# EAGLE design front_end_block (EAGLE 6.5.0)
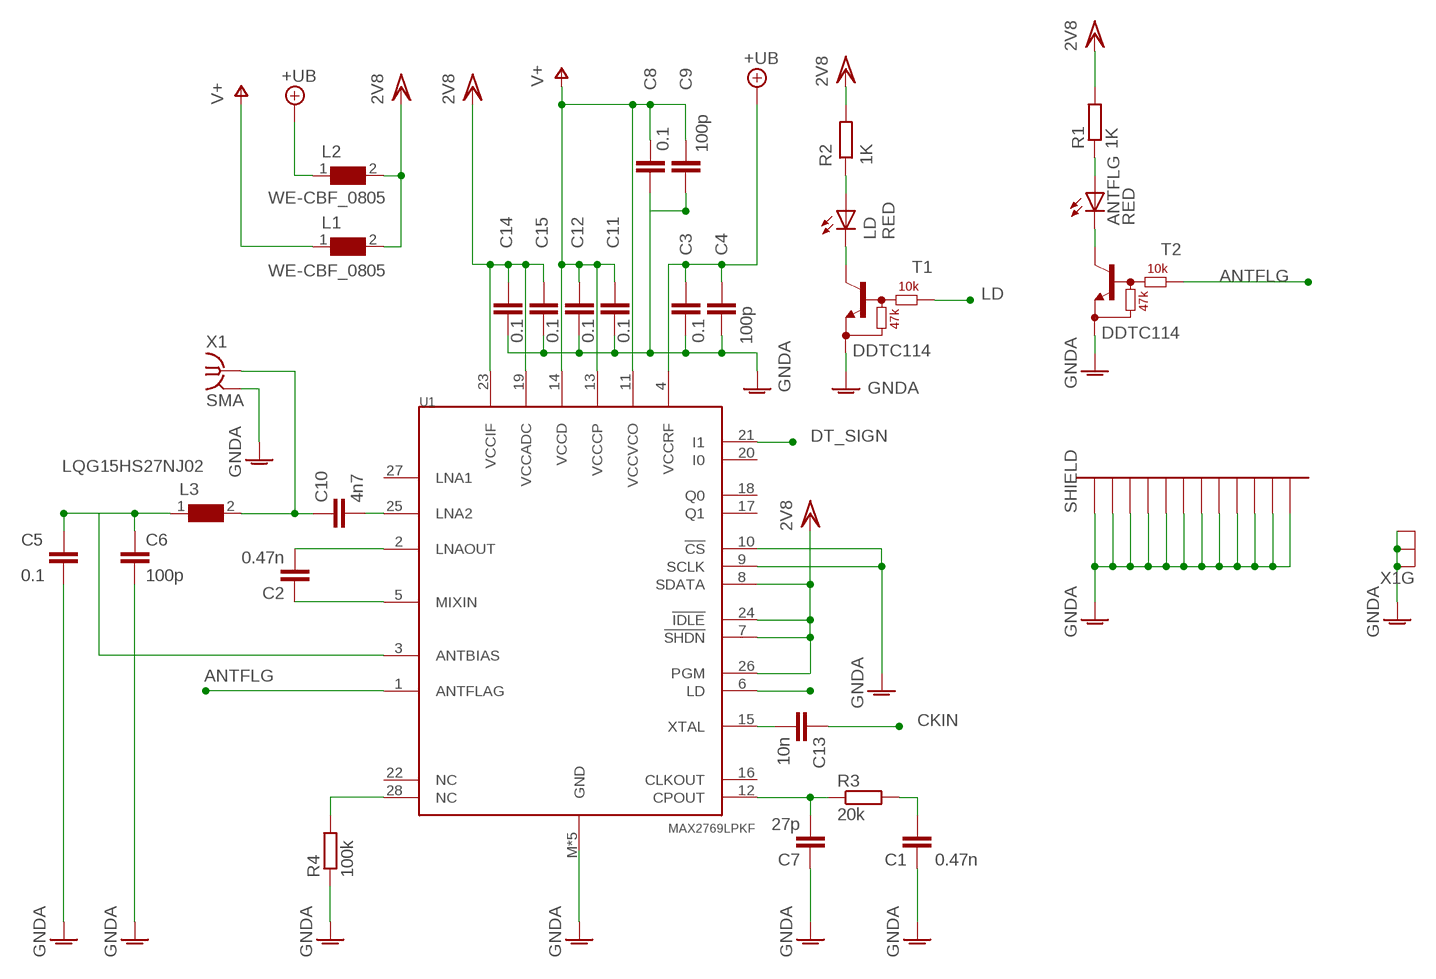
[diagram p0: schematic, sheet 1]

## Parts
ANTFLG  RED  LEDCHIP-LED0603  [CHIP-LED0603]
C1  0.47n  C-EUC0603  [C0603]
C2  0.47n  C-EUC0402  [C0402]
C3  0.1  C-EUC0402  [C0402]
C4  100p  C-EUC0402  [C0402]
C5  0.1  C-EUC0603  [C0603]
C6  100p  C-EUC0402  [C0402]
C7  27p  C-EUC0402  [C0402]
C8  0.1  C-EUC0402  [C0402]
C9  100p  C-EUC0402  [C0402]
C10  4n7  C-EUC0402  [C0402]
C11  0.1  C-EUC0402  [C0402]
C12  0.1  C-EUC0402  [C0402]
C13  10n  C-EUC0402  [C0402]
C14  0.1  C-EUC0603  [C0603]
C15  0.1  C-EUC0402  [C0402]
L1  WE-CBF_0805  [0805]
L2  WE-CBF_0805  [0805]
L3  LQG15HS27NJ02  WE-MK_0402  [0402]
LD  RED  LEDCHIP-LED0603  [CHIP-LED0603]
R1  1K  R-EU_R0402  [R0402]
R2  1K  R-EU_R0402  [R0402]
R3  20k  R-EU_R0402  [R0402]
R4  100k  R-EU_R0402  [R0402]
S2  BMIS-202  [BMIS-202]
T1  DDTC114  BCR135W  [SOT323-R_INFINEON]
T2  DDTC114  BCR135W  [SOT323-R_INFINEON]
U1  MAX2769LPKF  [QFN28LPKF]
X1  SMA  SMA-142-0701-801/806  [J502-ND-142-0701-801/806]

## Nets
+UB: C3.1 C4.1 L2.1 U1.4(VCCRF)
ANTFLG: T2.1(B) U1.1(ANTFLAG)
CKIN: C13.1
DT_SIGN: U1.21(I1)
GNDA: C1.1 C3.2 C4.2 C5.2 C6.2 C7.1 C8.2 C9.2 C11.2 C12.2 C14.2 C15.2 R4.1 S2.P$1(GND) S2.P$2(GND) S2.P$3(GND) S2.P$4(GND) S2.P$5(GND) S2.P$6(GND) S2.P$7(GND) S2.P$8(GND) S2.P$9(GND) S2.P$10(GND) S2.P$11(GND) S2.P$12(GND) T1.2(E) T2.2(E) U1.9(SCLK) U1.10(!CS) U1.M(GND) U1.P$4(GND) U1.P$6(GND) U1.P$7(GND) U1.P$9(GND) X1.G@1(GND) X1.G@2(GND) X1.G@3(GND) X1.G@4(GND)
LD: T1.1(B) U1.6(LD)
LNA2: C10.2 U1.25(LNA2)
LNAOUT: C2.2 U1.2(LNAOUT)
MIXIN: C2.1 U1.5(MIXIN)
N$1: C7.2 R3.1 U1.12(CPOUT)
N$3: C1.2 R3.2
N$5: C5.1 C6.1 L3.1 U1.3(ANTBIAS)
N$7: ANTFLG.A R1.1
N$8: ANTFLG.C T2.3(C)
N$16: LD.A R2.1
N$17: LD.C T1.3(C)
N$18: R4.2 U1.28(NC)
N$33: C10.1 L3.2 X1.1
V+: C8.1 C9.1 C11.1 C12.1 L1.1 U1.11(VCCVCO) U1.13(VCCCP) U1.14(VCCD)
VCC/2: C14.1 C15.1 L1.2 L2.2 R1.2 R2.2 U1.7(!SHDN) U1.8(SDATA) U1.19(VCCADC) U1.23(VCCIF) U1.24(!IDLE) U1.26(PGM) ; supply symbol labelled 2V8
XTAL: C13.2 U1.15(XTAL)
Unconnected: U1.16(CLKOUT) U1.17(Q1) U1.18(Q0) U1.20(I0) U1.22(NC) U1.27(LNA1)

## Library data of the parts
ANTFLG LD = led:LED: LED OSRAM: - CHIPLED LG R971, LG N971, LY N971, LG Q971, LY Q971, LO R971, LY R971 LH N974, LH R974 LS Q976, LO Q976, LY Q976 LO Q996 - Hyper CHIPLED LW Q18S LB Q993, LB Q99A, LB R99A - SideLED LS A670, LO A670, LY A670, LG A670, LP A670 LB A673, LV A673, LT A673, LW A673 LH A674 LY A675 LS A676, LA A676, LO A676, LY A676, LW A676 LS A679, LY A679, LG A679 - Hyper Micro SIDELED® LS Y876, LA Y876, LO Y876, LY Y876 LT Y87S - SmartLED LW L88C, LW L88S LB L89C, LB L89S, LG L890 LS L89K, LO L89K, LY L89K LS L896, LA L896, LO L896, LY L896 - TOPLED LS T670, LO T670, LY T670, LG T670, LP T670 LSG T670, LSP T670, LSY T670, LOP T670, LYG T670 LG T671, LOG T671, LSG T671 LB T673, LV T673, LT T673, LW T673 LH T674 LS T676, LA T676, LO T676, LY T676, LB T676, LH T676, LSB T676, LW T676 LB T67C, LV T67C, LT T67C, LS T67K, LO T67K, LY T67K, LW E67C LS E67B, LA E67B, LO E67B, LY E67B, LB E67C, LV E67C, LT E67C LW T67C LS T679, LY T679, LG T679 LS T770, LO T770, LY T770, LG T770, LP T770 LB T773, LV T773, LT T773, LW T773 LH T774 LS E675, LA E675, LY E675, LS T675 LS T776, LA T776, LO T776, LY T776, LB T776 LHGB T686 LT T68C, LB T68C - Hyper Mini TOPLED® LB M676 - Mini TOPLED Santana® LG M470 LS M47K, LO M47K, LY M47K Source: http://www.osram.convergy.de LUXEON: - LUMILED® LXK2-PW12-R00, LXK2-PW12-S00, LXK2-PW14-U00, LXK2-PW14-V00 LXK2-PM12-R00, LXK2-PM12-S00, LXK2-PM14-U00 LXK2-PE12-Q00, LXK2-PE12-R00, LXK2-PE12-S00, LXK2-PE14-T00, LXK2-PE14-U00 LXK2-PB12-K00, LXK2-PB12-L00, LXK2-PB12-M00, LXK2-PB14-N00, LXK2-PB14-P00, LXK2-PB14-Q00 LXK2-PR12-L00, LXK2-PR12-M00, LXK2-PR14-Q00, LXK2-PR14-R00 LXK2-PD12-Q00, LXK2-PD12-R00, LXK2-PD12-S00 LXK2-PH12-R00, LXK2-PH12-S00 LXK2-PL12-P00, LXK2-PL12-Q00, LXK2-PL12-R00 Source: www.luxeon.com KINGBRIGHT: KA-3528ASYC Source: www.kingbright.com
C1-C4 C6-C15 = rcl_1:C-EU: CAPACITOR, European symbol
C5 = rcl:C-EU: CAPACITOR, European symbol
L1 L2 = EagleLibrary_Wuerth_Elektronik_eiSos_Version_6-9:WE-CBF: SMD EMI Suppression Ferrite Beads WE-CBF - Excellent anti-EMI properties - Low DC-restistance - Impedances till 3000 ohms - Rated current up to 6 A -- Reliable Ni-Sn electrodes -- Perfect as data lined filter and for uncoupling of distribution voltage
L3 = wuerth_elektronik_eisos__v6.12:WE-MK: SMD Multilayer Ceramic Inductors WE-MK - Windings printed on ceramic substrate - Extremely high SRF > 15 GHz - Inductance is stable over temperature -- High frequency circuits -- Bluetooth -- Wireless LAN -- Filter circuits
R1-R4 = rcl:R-EU_: RESISTOR, European symbol
S2 = laird:BMIS-202: Laird BMI-S-202 EMI Shield
T1 T2 = digital-transistors-2:BCR135: NPN Silicon Digital Transistor 50V 0,1A 0,2W
U1 = maxim1:MAX2769: Universal GPS Receiver
X1 = con-coax:SMA-: SMA 50 Ohm End Launch Jack Receptacle - Round Contact Johnson Components Source: www.johnsoncomponents.com .. J502-ND.pdf; MF: JOHNSON COMPONENTS; MPN: 142-0701-801; OC_FARNELL: 1608592; OC_NEWARK: 90F2624

## Board
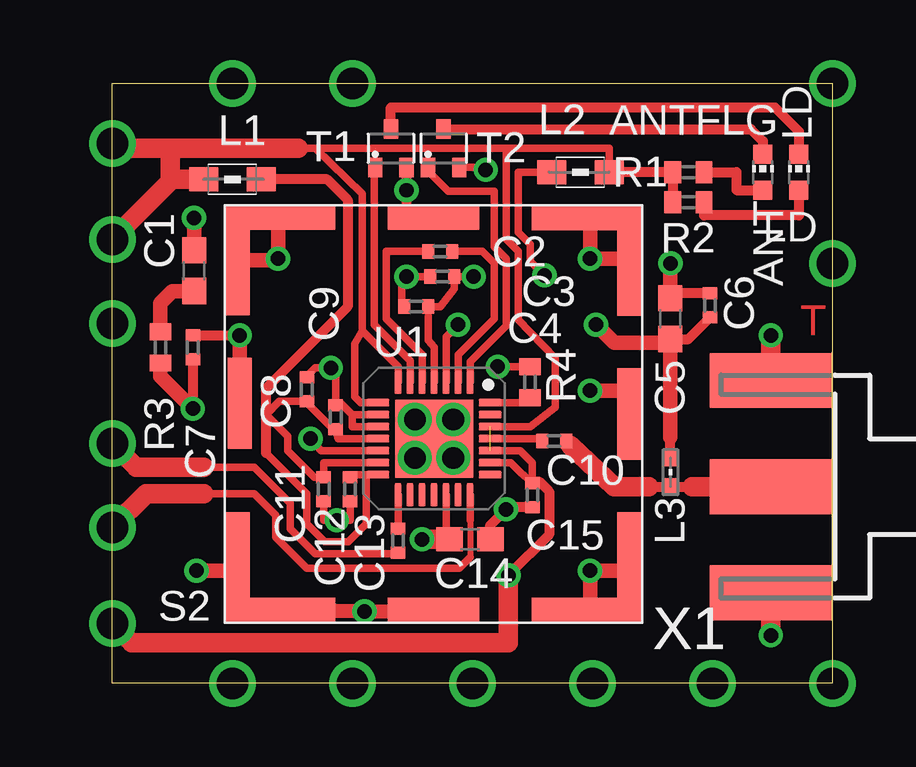
[diagram p1: board, top side]
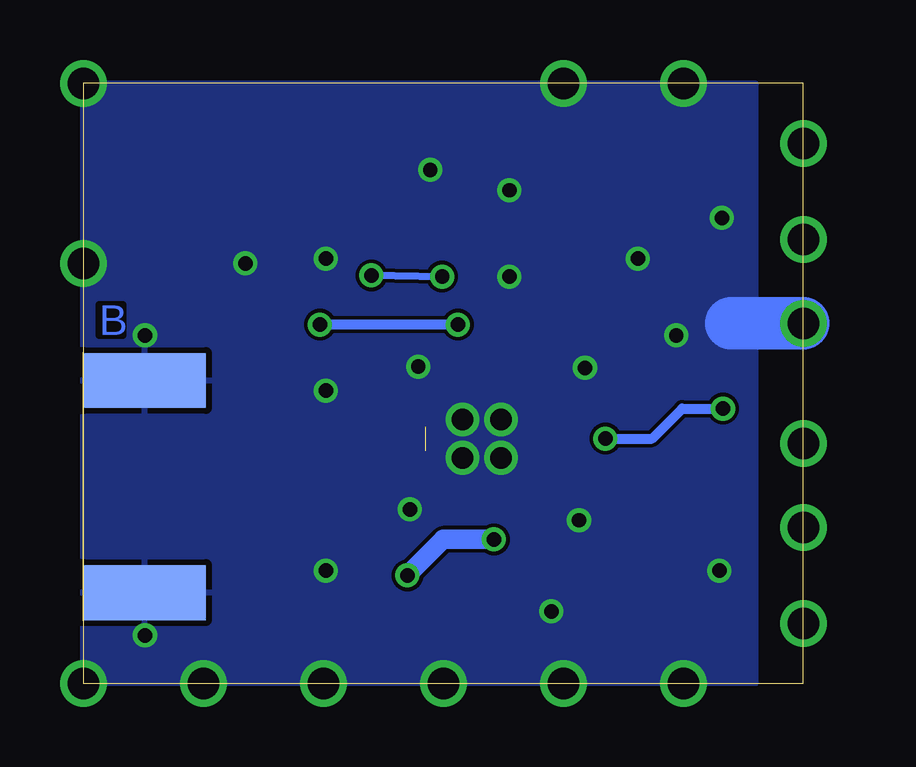
[diagram p2: board, bottom side, seen from below]

Size 30 x 25 mm. Coordinates in mm from the lower left corner, seen from the top.
Outline: 0,25 30,25 30,0 0,0 0,25
Copper layers (1*16): Top 0.035mm / dielectric 1.5mm / Bottom 0.035mm
Design rules "default *": minimum track width 0.25mm, minimum drill 0.6mm, track to track 6mil, track to pad 6mil, pad to pad 6mil, via to via 6mil, smd to smd 6mil, copper to edge 0mil, drill to drill 8mil, minimum pad ring 10mil, minimum via ring 8mil, stop-mask expansion 4mil, vias tented up to drill 0.7mm, thermal gap 10mil

### Footprints (pad centres in the part's own frame; a part is rotated, then mirrored left to right if it is on the bottom)
CHIP-LED0603 = smd 0.8 x 0.8: A 0,-0.75; C 0,0.75
C0603 = smd 1.1 x 1: 1 -0.85,0; 2 0.85,0
C0402 = smd 0.5 x 0.6: 1 -0.5,0; 2 0.5,0
0805 = smd 1.2 x 1: 1 -1.2,0; 2 1.2,0
0402 = smd 0.7 x 0.6: 1 -0.6,0; 2 0.6,0
R0402 = smd 0.7 x 0.9: 1 -0.65,0; 2 0.65,0
BMIS-202 = smd 1 x 4.55: P$1 -7.675,-6.35; P$2 -7.675,6.425; P$3 8.625,6.4; P$4 8.625,-6.35 | smd 1 x 3.8: P$5 -7.6,0.475; P$7 8.625,0.025 | smd 3.8 x 1: P$6 0.475,8.2; P$8 0.475,-8.125 | smd 3.55 x 1: P$9 -5.4,-8.125; P$10 -5.4,8.2; P$11 6.35,8.175; P$12 6.35,-8.125
SOT323-R_INFINEON = smd 0.6 x 0.8: 1 -0.65,-0.8; 2 0.65,-0.8; 3 0,0.8
QFN28LPKF = smd 0.95 x 0.3: 1 -2.34,1.5; 2 -2.34,1; 3 -2.34,0.5; 4 -2.34,0; 5 -2.34,-0.5; 6 -2.34,-1; 7 -2.34,-1.5; 15 2.34,-1.5; 16 2.34,-1; 17 2.34,-0.5; 18 2.34,0; 19 2.34,0.5; 20 2.34,1; 21 2.34,1.5 | smd 0.3 x 0.95: 8 -1.5,-2.34; 9 -1,-2.34; 10 -0.5,-2.34; 11 0,-2.34; 12 0.5,-2.34; 13 1,-2.34; 14 1.5,-2.34; 22 1.5,2.34; 23 1,2.34; 24 0.5,2.34; 25 0,2.34; 26 -0.5,2.34; 27 -1,2.34; 28 -1.5,2.34 | smd 3.25 x 3.25: M 0,0 | drill 0.9: P$4 0.8,0.8; P$6 -0.8,0.8; P$7 -0.8,-0.8; P$9 0.8,-0.8
J502-ND-142-0701-801/806 = smd 5.08 x 2.286: 1 2.565,0; G@1 2.565,4.42; G@2 2.565,-4.42 | smd 5.08 x 2.286 bottom: G@3 2.565,4.42; G@4 2.565,-4.42

### Placement (x,y rotation side)
ANTFLG  27.1,21.3 0 top
C1  3.4,17.2 270 top
C2  13.65,18 0 top
C3  13.75,16.95 180 top
C4  12.65,15.7 180 top
C5  23.25,15.2 90 top
C6  24.9,15.75 90 top
C7  3.35,14 270 top
C8  8.1,12.25 90 top
C9  9.3,11.1 90 top
C10  18.4,10.1 180 top
C11  8.8,8.1 270 top
C12  9.9,8.1 270 top
C13  11.9,5.95 90 top
C14  14.9,6 0 top
C15  17.5,7.85 270 top
L1  5,21 180 top
L2  19.5,21.3 0 top
L3  23.25,8.8 270 top
LD  28.6,21.3 0 top
R1  24,21.3 180 top
R2  24,20.05 180 top
R3  2,14 90 top
R4  17.4,12.55 270 top
S2  12.9,11.2 0 top
T1  11.6,22.3 0 top
T2  13.8,22.3 0 top
U1  13.4,10.2 270 top
X1  30,8.2 180 top

### Tracks (layer width: path | path; a pad name or v marks a point on that pad's centre or on a via)
+UB  (via drill 0.6)
  Top 0.254: 13.15,15.3 C4.1
  Top 0.305: U1.4 13.4,14 13.15,14.3 13.15,15.3 | C4.1 13.65,15.7 14.25,16.45 C3.1 v15.05,16.95 | v18,17 17.4,17.6 17.4,18.3 16.9,18.8 16.9,21.3 L2.1
  Bottom 0.305: v18,17 v15.05,16.95
ANTFLG
  Top 0.305: U1.1 14.9,13.4 16.4,14.9 16.4,17.7 15.9,18.2 15.9,20.5 13.98,20.5 13.15,21.34 T2.1
CKIN  (via drill 1.3 pad 1.93)
  Top 0.305: 3.8,9 5.9,9 7.4,7.5 7.4,6.45 8.45,5.4 11.85,5.4 C13.1
  Top 0.813: v0,10 1,9 3.8,9
DT_SIGN  (via drill 1.3 pad 1.93)
  Top 0.254: 14.9,6.8 14.9,5.25
  Top 0.305: 3.8,7.9 5.9,7.9 6.8,7 6.8,6.1 8.1,4.8 14.45,4.8 14.9,5.25 | U1.21 14.9,6.8
  Top 0.813: v0,6.5 1.4,7.9 3.8,7.9
GNDA  (via drill 0.6, 1.3 pad 1.93)
  Top 0.254: S2.P$8 12.5,2.98 13,3.1 | 9.5,11.7 C9.2 | C4.2 12.05,15.7 | U1.M 12.18,11.25 U1.P$7
  Top 0.305: U1.10 10,10.7 10,11.2 | C9.2 9.3,13.05 v9.1,13.15 8.45,13.15 8.1,12.8 C8.2 | U1.9 10,11.2 | 10,11.2 9.5,11.7 | 12.05,15.7 12.05,16.75 v12.25,16.95 C3.2 | R4.1 17.4,13.1 | 17.4,13 17.4,13.1 | 17.4,13.1 17.3,13.2 v16.05,13.2 | S2.P$6 13.4,19.4 | C11.2 8.8,6.8 v9.35,6.8 9.9,6.8 C12.2 | T2.2 15.45,21.5 v15.55,21.4
  Top 0.406: C15.2 16.5,7.35 v16.4,7.25 15.75,6.6 C14.2 | T1.2 v12.25,20.55 12.25,19.4 S2.P$6 | C6.2 23.25,16.25 C5.2 | C7.1 v5.3,14.5
  Top 0.61: S2.P$12 19.9,3.05 v19.9,4.7 21.55,4.7 S2.P$4 | S2.P$1 5.22,4.7 v3.5,4.7 | S2.P$9 6.9,3.08 v10.5,3 12.5,2.98 | S2.P$2 6.9,17.62 v6.9,17.7 6.9,19.2 7.5,19.2 S2.P$10 | S2.P$3 21.4,16.6 21.4,17.7 v19.9,17.7 19.9,19.38 S2.P$11 | S2.P$5 v5.3,14.5 | v19.9,12.2 21.52,12.2 S2.P$7 | v23.25,17.5 C5.2 | v3.4,19.4 C1.1
  Top 0.813: X1.G@3 v27.43,2 | X1.G@4 v27.43,14.5
  Bottom 2.184: v0,15 3,15
  other vias: 5,0 15,0 20,0 25,0 10,0 5,25 10,25 30,0 30,25 30,17.5
  pour Bottom: 2,0 30,0 30,25 2,25
LD
  Top 0.305: U1.6 12.4,13.45 10.9,14.95 10.9,21.45 T1.1
LNA2
  Top 0.305: U1.25 17.7,10.2 17.9,10 C10.2
LNAOUT
  Top 0.305: C2.2 15.4,18 15.9,17.5 15.9,15.2 14.4,13.7 U1.2
MIXIN
  Top 0.305: U1.5 12.9,13.7 11.4,15.2 11.4,18 C2.1
N$1  (via drill 0.6)
  Top 0.305: U1.12 8.7,9.7 v8.25,10.2
  Top 0.406: C7.2 v3.35,11.45
  Top 0.61: R3.1 2,12.8 v3.35,11.45
  Bottom 0.406: v8.25,10.2 6.3,10.2 5.05,11.45 v3.35,11.45
N$3
  Top 0.61: R3.2 2,15.85 2.5,16.35 C1.2
N$5  (via drill 0.6)
  Top 0.254: C5.1 23.15,14.2
  Top 0.305: U1.3 13.9,14.45 v14.4,14.95
  Top 0.406: L3.1 23.25,10.25 | C5.1 24,14.35 C6.1
  Top 0.61: v20.15,14.95 20.9,14.2 23.15,14.2 | 23.25,10.25 C5.1
  Bottom 0.406: v14.4,14.95 v20.15,14.95
N$7
  Top 0.406: R1.1 26,21.3 26,20.55 ANTFLG.A
N$8
  Top 0.406: T2.3 26.6,23.1 27.1,22.6 ANTFLG.C
N$16
  Top 0.406: LD.A 28.6,19.5 24.65,19.5 R2.1
N$17
  Top 0.406: T1.3 11.6,24 27.6,24 28.6,23 LD.C
N$18
  Top 0.305: R4.2 17.4,11.7 U1.28
N$33
  Top 0.305: 27.9,8.2 X1.1
  Top 0.406: 19.1,9.9 C10.1 | 22.35,8.2 L3.2 24.15,8.2
  Top 0.813: 19.1,9.9 20.9,8.2 22.35,8.2 | 24.15,8.2 X1.1
V+
  Top 0.254: C9.1 9.4,10.35
  Top 0.305: C9.1 9.4,10.2 U1.11 | 9.4,10.35 9.25,10.55 8.2,11.6 C8.1 6.95,11.75 6.4,11.2 7.3,10.3 7.3,9.7 8.4,8.6 C11.1 8.8,9.2 U1.13 | 9.9,8.57 C12.1 9.9,8.7 10.57,8.7 | 6.4,9.6 8.1,7.9 8.1,6.65 8.85,5.9 9.82,5.9 10.57,6.65 10.57,8.7 | U1.14 10.57,8.7
  Top 0.406: 6.4,9.6 6.4,11.2 6.4,12.3 9.8,15.7 9.8,20.15 8.95,21 L1.1
VCC/2  (via drill 0.6, 1.3 pad 1.93)  (1 unrouted)
  Top 0.305: U1.7 11.9,13.2 10.4,14.7 | U1.26 17.4,10.7 18.45,11.5 18.45,13.55 16.9,15.15 16.9,18 16.4,18.5 16.4,22.3 | U1.8 10.35,11.7 10.1,11.95 10.1,14.15 10.4,14.7 | U1.24 17,9.7 17.5,9.2 C15.1 17.45,8.4 17,8.8 16.6,9.2 U1.23 | 7.75,22.3 8.45,22.3 | 8.45,22.3 16.4,22.3 | 16.4,22.3 20.7,22.3 L2.2 | 10.4,14.7 10.4,20.4 8.45,22.3 | U1.19 13.9,6 C14.1
  Top 0.406: C15.1 17.55,8.4 17.8,8.4 18.2,8 18.2,6.2 v16.5,4.5 | L2.2 R1.2 R2.2
  Top 0.813: 2.4,22.3 2.4,21 2.5,21 | 2.4,22.3 7.75,22.3 | L1.2 2.5,21 | v16.5,4.5 16.5,1.7 0.8,1.7 v0,2.5 | v0,22.5 0.2,22.3 2.4,22.3 | v0,18.5 2.5,21 | C14.1 v12.9,6
  Bottom 0.813: v12.9,6 15,6 v16.5,4.5
XTAL
  Top 0.305: U1.15 C13.2

### Text on the board
Top: T
Bottom: B
_tsilk: LD | L1 | L2 | T1 | T2 | R1 | C1 | ANT | R2 | C2 | C3 | C4 | C6 | C9 | U1 | R4 | C5 | C7 | C8 | R3 | C11 | C10 | L3 | C12 | C15 | C13 | C14 | S2 | X1